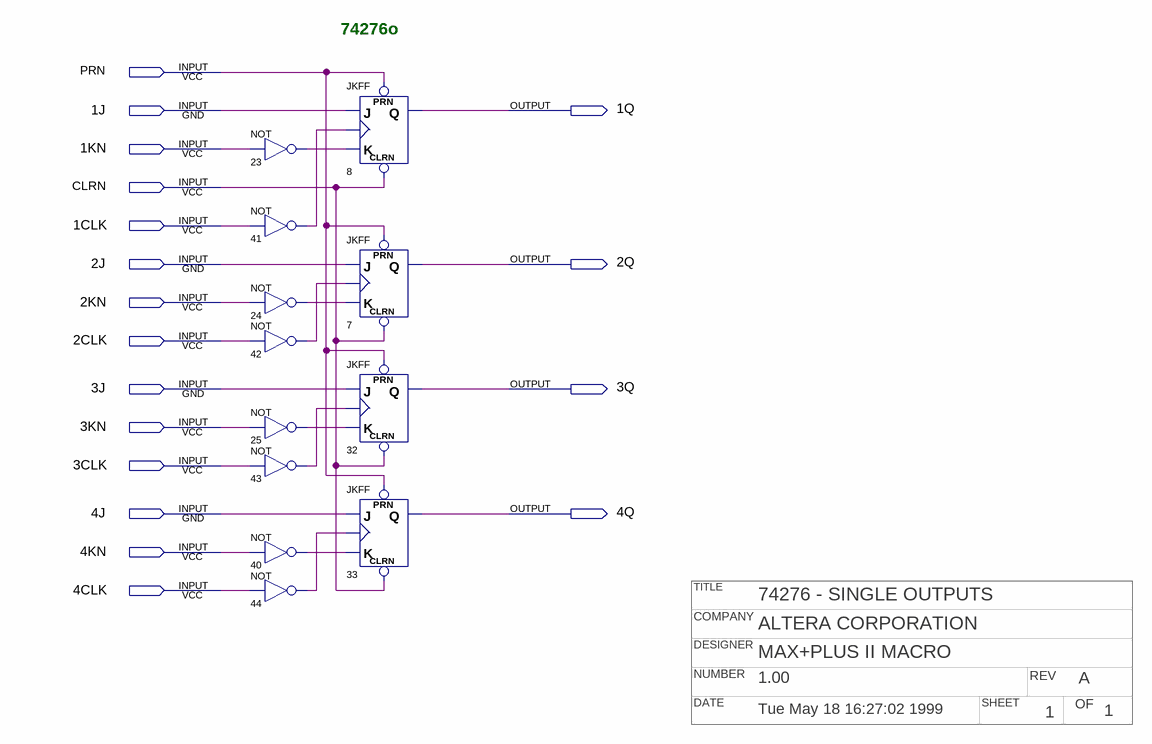
[diagram p0: schematic sheet]
// Quartus schematic 74276o.bdf as structural Verilog: 12 symbols, 18 pins
// Title block: TITLE: 74276 - SINGLE OUTPUTS; COMPANY: ALTERA CORPORATION; DESIGNER: MAX+PLUS II MACRO; NUMBER: 1.00; REV: A; DATE: Tue May 18 16:27:02 1999; SHEET: 1; OF: 1
module \74276o  (
  input  PRN,
  input  \1J ,
  input  \1KN ,
  input  CLRN,
  input  \1CLK ,
  input  \2J ,
  input  \2KN ,
  input  \2CLK ,
  input  \3J ,
  input  \3KN ,
  input  \3CLK ,
  input  \4J ,
  input  \4KN ,
  input  \4CLK ,
  output \1Q ,
  output \2Q ,
  output \3Q ,
  output \4Q 
);

  wire n23_out, n24_out, n25_out, n40_out, n41_out, n42_out, n43_out, n44_out;

  not u_23 (n23_out, \1KN );
  not u_41 (n41_out, \1CLK );
  not u_24 (n24_out, \2KN );
  not u_42 (n42_out, \2CLK );
  not u_25 (n25_out, \3KN );
  not u_43 (n43_out, \3CLK );
  not u_40 (n40_out, \4KN );
  not u_44 (n44_out, \4CLK );
  JKFF u_8 (.PRN(PRN), .CLRN(CLRN), .K(n23_out), .J(\1J ), .CLK(n41_out), .Q(\1Q ));
  JKFF u_7 (.PRN(PRN), .CLRN(CLRN), .K(n24_out), .J(\2J ), .CLK(n42_out), .Q(\2Q ));
  JKFF u_32 (.PRN(PRN), .CLRN(CLRN), .K(n25_out), .J(\3J ), .CLK(n43_out), .Q(\3Q ));
  JKFF u_33 (.PRN(PRN), .CLRN(CLRN), .K(n40_out), .J(\4J ), .CLK(n44_out), .Q(\4Q ));

  // Notes on the sheet:
  //   74276o
endmodule
